# Altium project CubeSatTelemetry2.PrjPcb (part 2 of 2)

## Sheet LTEMSubsystem.SchDoc
size A3; SheetNumber: 4; SheetTotal: 14
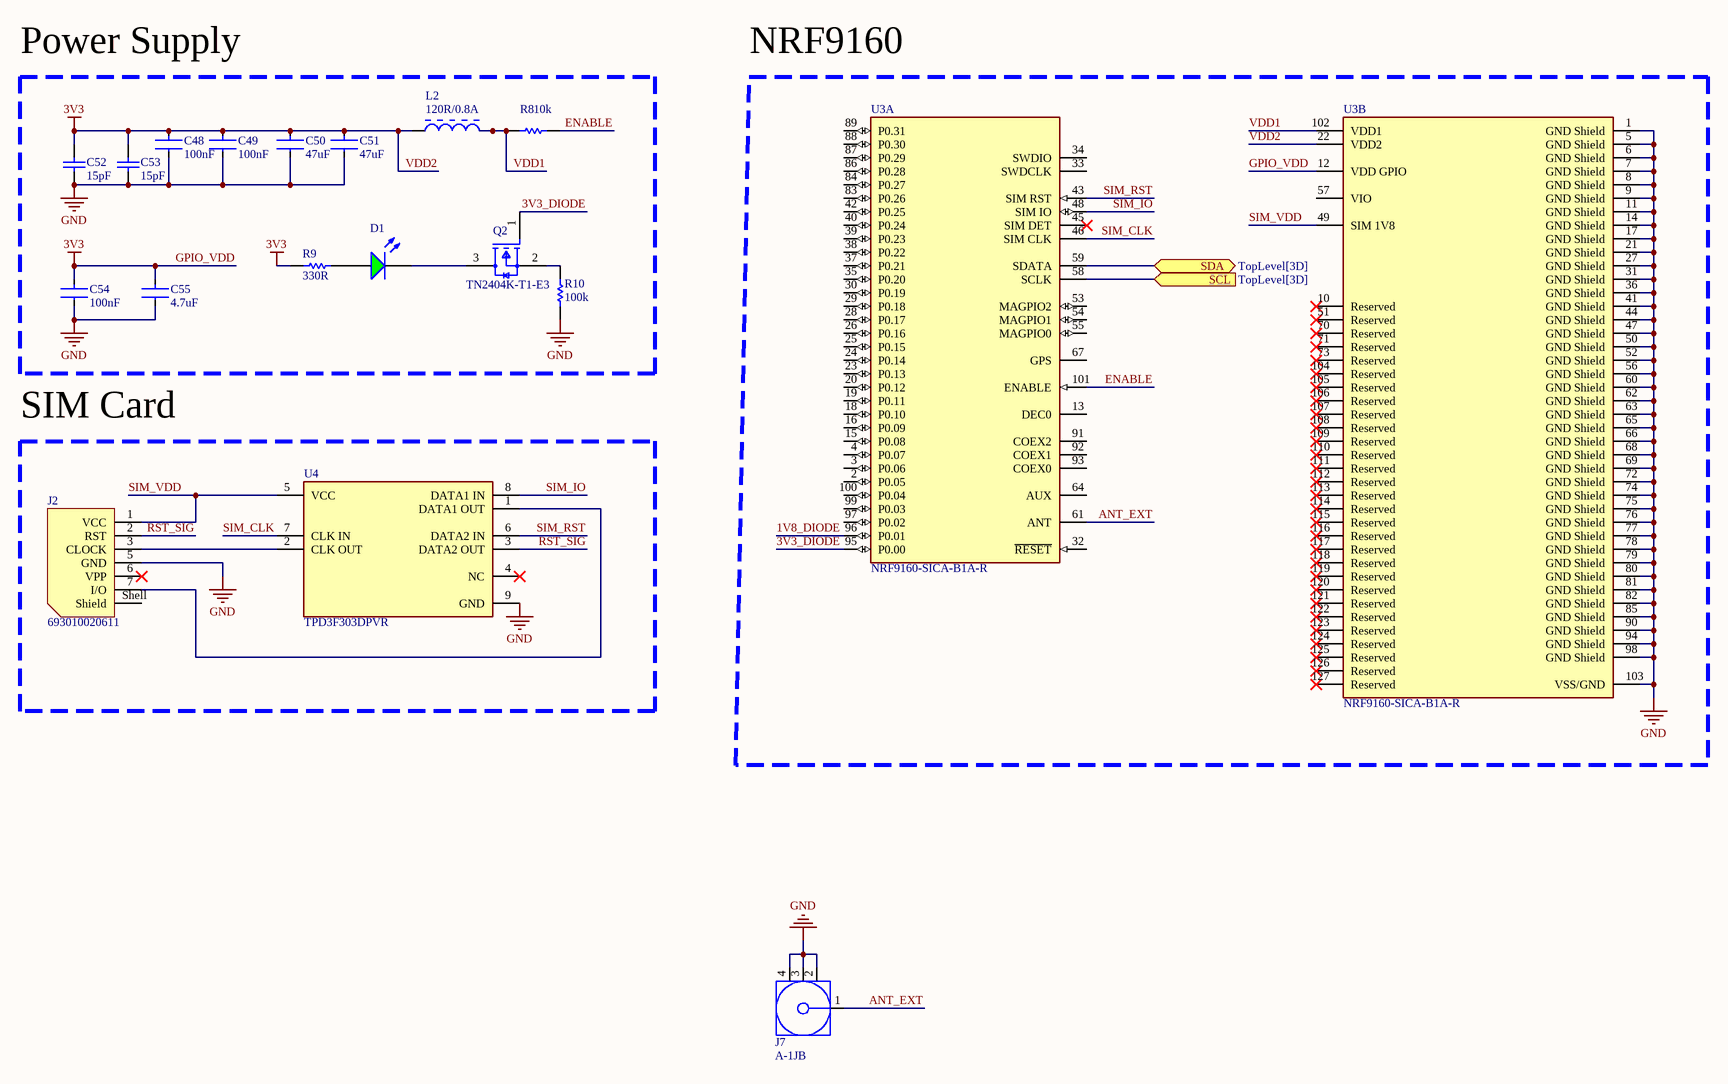
[diagram p6: LTEMSubsystem.SchDoc]

### Parts
C48  100nF  [FP-GRM033-0_03-MFG]
C49  100nF  [FP-GRM033-0_03-MFG]
C50  47uF  [FP-C3216-160-0_2-MFG]
C51  47uF  [FP-C3216-160-0_2-MFG]
C52  15pF  [CAPC1508X91X25LL25T13]
C53  15pF  [CAPC1508X91X25LL25T13]
C54  100nF  [FP-GRM033-0_03-MFG]
C55  4.7uF  [FP-C0603-CG-MFG]
D1  (no value)  [WL-SMRW_1206_cylindrical_reverse use]
J2  693010020611  [693010020611]
J7  A-1JB  [AMPH-A-1JB_V]
L2  120R/0.8A  [LIRD-LI0805H151R-10-2_V]
Q2  TN2404K-T1-E3  [FP-S-03946-MFG]
R8  10k  [RESC1609X50X30NL8T20]
R9  330R  [RESC1005X40X25ML05T05]
R10  100k  [RESC1005X40X25NL10T10]
U3  NRF9160-SICA-B1A-R  [FP-NRF9160-SICA-B1A-R-MFG]  (parts A,B of 2)
U4  TPD3F303DPVR  [FP-DPV0008A-IPC_C]

### Blocks framed on the sheet
Power Supply: C48-C55 D1 L2 Q2 R8-R10
NRF9160: U3
SIM Card: J2 U4

### Ports
SCL (in, see TopLevel[3D]), SDA (bidir, see TopLevel[3D])

### Nets
GND: C48.2 C49.2 C50.2 C51.2 C52.1 C53.1 C54.2 C55.2 J2.5(GND) J7.2 J7.3 J7.4 R10.2 U3.1(GND_Shield) U3.5(GND_Shield) U3.6(GND_Shield) U3.7(GND_Shield) U3.8(GND_Shield) U3.9(GND_Shield) U3.11(GND_Shield) U3.14(GND_Shield) U3.17(GND_Shield) U3.21(GND_Shield) U3.27(GND_Shield) U3.31(GND_Shield) U3.36(GND_Shield) U3.41(GND_Shield) U3.44(GND_Shield) U3.47(GND_Shield) U3.50(GND_Shield) U3.52(GND_Shield) U3.56(GND_Shield) U3.60(GND_Shield) U3.62(GND_Shield) U3.63(GND_Shield) U3.65(GND_Shield) U3.66(GND_Shield) U3.68(GND_Shield) U3.69(GND_Shield) U3.72(GND_Shield) U3.74(GND_Shield) U3.75(GND_Shield) U3.76(GND_Shield) U3.77(GND_Shield) U3.78(GND_Shield) U3.79(GND_Shield) U3.80(GND_Shield) U3.81(GND_Shield) U3.82(GND_Shield) U3.85(GND_Shield) U3.90(GND_Shield) U3.94(GND_Shield) U3.98(GND_Shield) U3.103(VSS/GND) U4.9(GND)
GPIO_VDD: C48.1 C49.1 C50.1 C51.1 C52.2 C53.2 C54.1 C55.1 L2.1 R9.1 U3.12(VDD_GPIO) U3.22(VDD2)  [also labelled 3V3, VDD2]
1V8_DIODE: U3.96(P0.01)
3V3_DIODE: Q2.1(G) U3.95(P0.00)
ANT_EXT: J7.1 U3.61(ANT)
ENABLE: R8.2 U3.101(ENABLE)
RST_SIG: J2.2(RST) U4.3(DATA2_OUT)
SIM_CLK: U3.46(SIM_CLK) U4.7(CLK_IN)
SIM_IO: U3.48(SIM_IO) U4.8(DATA1_IN)
SIM_RST: U3.43(SIM_RST) U4.6(DATA2_IN)
SIM_VDD: J2.1(VCC) U3.49(SIM_1V8) U4.5(VCC)
VDD1: L2.2 R8.1 U3.102(VDD1)
NetD1_1: D1.1(K) Q2.3(D)
NetD1_2: D1.2(A) R9.2
NetJ2_3: J2.3(CLOCK) U4.2(CLK_OUT)
NetJ2_7: J2.7(I/O) U4.1(DATA1_OUT)
NetQ2_2: Q2.2(S) R10.1
NetR39_2: U3.59(SDATA) ; port SDA
NetR40_2: U3.58(SCLK) ; port SCL

Not connected (* = marked no-connect by the designer): J2 6(VPP)* Shell(Shield); U3 2(P0.05) 3(P0.06) 4(P0.07) 10(Reserved)* 13(DEC0) 15(P0.08) 16(P0.09) 18(P0.10) 19(P0.11) 20(P0.12) 23(P0.13) 24(P0.14) 25(P0.15) 26(P0.16) 28(P0.17) 29(P0.18) 30(P0.19) 32(~{RESET}) 33(SWDCLK) 34(SWDIO) 35(P0.20) 37(P0.21) 38(P0.22) 39(P0.23) 40(P0.24) 42(P0.25) 45(SIM_DET)* 51(Reserved)* 53(MAGPIO2) 54(MAGPIO1) 55(MAGPIO0) 57(VIO) 64(AUX) 67(GPS) 70(Reserved)* 71(Reserved)* 73(Reserved)* 83(P0.26) 84(P0.27) 86(P0.28) 87(P0.29) 88(P0.30) 89(P0.31) 91(COEX2) 92(COEX1) 93(COEX0) 97(P0.02) 99(P0.03) 100(P0.04) 104(Reserved)* 105(Reserved)* 106(Reserved)* 107(Reserved)* 108(Reserved)* 109(Reserved)* 110(Reserved)* 111(Reserved)* 112(Reserved)* 113(Reserved)* 114(Reserved)* 115(Reserved)* 116(Reserved)* 117(Reserved)* 118(Reserved)* 119(Reserved)* 120(Reserved)* 121(Reserved)* 122(Reserved)* 123(Reserved)* 124(Reserved)* 125(Reserved)* 126(Reserved)* 127(Reserved)*; U4 4(NC)*

### Library data of the parts
C48 C49 C54 = CMP-06035-000062-2: GRM033R60J104KE19D; Dielectric: X5R; Voltage Rating (DC): 6.3V; Material: Ceramic; Tolerance: 10%; Min Operating Temperature: -55°C; Lead Free: Lead Free; Radiation Hardening: No; REACH SVHC: No SVHC; Case/Package: 0201; Voltage Rating: 6.3V; Length: 0.6mm; Max Operating Temperature: 85°C; Width: 0.012inch; Depth: 0.3mm; Case Code (Metric): 0603; Thickness: 0.013inch; Packaging: Tape and Reel; Height: 0.3mm; Capacitance: 100nF; Weight: 6E-06oz; Package Quantity: 1; Mount: Surface Mount; Voltage: 6.3V; Case Code (Imperial): 0201; Termination: SMD/SMT
C50 C51 = CMP-2000-07442-2: C3216X5R1C476M160AB; Dielectric: X5R; Dielectric Material: Ceramic; Tolerance: 20%; Voltage Rating (DC): 16V; Resistor Type: Ceramic; Width: 0.063inch; Case Code (Imperial): 1206; Radiation Hardening: No; Thickness: 0.071inch; Weight: 0.000571oz; Termination: SMD/SMT; Min Operating Temperature: -55°C; Depth: 1.6mm; Case Code (Metric): 3216; Max Operating Temperature: 85°C; RoHS Compliant: Yes; REACH SVHC: No SVHC; Mount: Surface Mount; Lead Free: Lead Free; Height: 1.6mm; Length: 3.2mm; Capacitance: 47uF; Package Quantity: 1; Construction: Flat; Packaging: Tape and Reel; Series: C; Case/Package: 1206; Voltage Rating: 16V
C52 C53 = CMP-2006-04659-1: 06032U150GAT2A; Manufacturer: AVX Interconnect / Elco; Part Number: 06032U150GAT2A
C55 = CMP-2006-02256-2: C0603C475K9PACTU; Manufacturer: Kemet; Temperature Coefficient: 15%; Tolerance: 10%; Voltage Rating: 6.3V; Material: Ceramic; Temperature Characteristic: X5R; Device Class L3: Ceramic Capacitors; RoHS: TRUE; Value: 4.7uF; Lead Free: Yes; ComponentLink2Description: Datasheet; Mouser Description: Multilayer Ceramic Capacitors MLCC - SMD/SMT 6.3volts 4.7uF X5R 10%; Package: C0603-CG; Digikey Description: CAP CER 4.7UF 6.3V X5R 0603; ComponentLink2URL: https://content.kemet.com/datasheets/KEM_C1006_X5R_SMD.pdf; Category: Cap; Temperature Range Low: -55°C; Capacitance: 4.7uF; Temperature: -55°C to +85°C; Octopart: https://octopart.com/c0603c475k9pactu-kemet-104242; Ipc Land Pattern Name: CAPC16080X80; Temperature Range High: +85°C; Height: 0.9mm; Device Class L1: Passive Components; Manufacturer Part Number: C0603C475K9PACTU; Automotive: No; Device Class L2: Capacitors
D1 = CMP-1428-00004-3: 156120GS75300; NexarPartId: 29717826; Reverse Voltage: 5V; Forward Current: 100mA; Luminous Intensity: 235mcd; Lens Style: Cylindrical; Power Dissipation: 95mW; Test Current: 20mA; Forward Voltage: 3.3V; Peak Wavelength: 520nm; Wavelength: 525nm; Viewing Angle: 140°; Color: Green; Case Code (Metric): 3216; Height: 1.2mm; RoHS: Compliant; Packaging: Tape and Reel; Width: 1.6mm; Lead Free: Lead Free; Case/Package: 1206; Length: 3.2mm; Max Operating Temperature: 85°C; REACH SVHC: Unknown; Dominant Wavelength: 525nm; Min Operating Temperature: -40°C; Mount: Surface Mount; Case Code (Imperial): 1206; Max Reverse Voltage (DC): 5V
J2 = CMP-1502-00155-2: NexarPartId: 22862857; Connector Type: Connector, Socket; Operating Supply Voltage: 50V; Insulation Resistance: 500MΩ; Number of Contacts: 6; Current Rating: 500mA; Max Operating Temperature: 85°C; Number of Pins: 6; Min Operating Temperature: -25°C; Mount: Surface Mount; Contact Material: Copper; REACH SVHC: Unknown; Packaging: Tape and Reel; Length: 16.4mm; Width: 16.3mm; RoHS: Compliant; Height: 1.8mm; Number of Positions: 6; Contact Plating: Gold
J7 = CMP-1743-00001-1: AMC PCB Jack, 0 to 60 GHz, 60 V, -40 to 90 degC, 4-Pin SMD, RoHS, Tape and Reel; Capacitance: 100 uF; Case\Package: 2917; Voltage Rating (DC): 10 V; ESR: 700 mohm; Tolerance: 10%; ComponentLink1Description: Datasheet; PackageDescription: 4-Pin Surface Mount Device, Body 2.6 x 2.6 mm; Radiation Hardening: No; Package Quantity: 1; REACH SVHC: No SVHC; DatasheetVersion: Rev. K, 05/2016; ComponentLink1URL: http://drawings.amphenolrf.com/Customer_Outline/CA-1JB.pdf; Pins: 2; Packaging: Tape and Reel; Min Operating Temperature: -55 degC; RoHSCompliant: true; Length: 7.3 mm; PackageReference: A-1JB; Weight: 0.023634 oz; Mount: Surface Mount; Voltage Rating: 10 V; Max Operating Temperature: 125 degC; Height: 3.1 mm; Case Code (Imperial): 2917; Case Code (Metric): 7343; Width: 4.3 mm
L2 = CMP-2000-06542-1: LI0805H121R-10; Manufacturer: Laird; Package Version: Rev. D, 08/2013; Impedance @ Frequency: 120Ohm@100MHz; Other Names: 240-2383-1; Kits: 240-2227-ND-KITEMIFERRITEBEADCHIPSMD; DC Resistance (DCR) (Max): 150mOhm; Online Catalog: LISeries; Filter Type: SignalLine; Number of Lines: 1; Catalog Drawings: (HI,HZ,LI,MI)0805Series_1.10mmMax.Height; Current Rating (Max): 800mA; Category: Filters; Size / Dimension: 0.079"Lx0.049"W(2.00mmx1.25mm); Operating Temperature: -40°C~125°C; Datasheet Version: Rev. E, 08/2013; Datasheet URL: http://cdn.lairdtech.com/home/brandworld/files/LI0805H121R-10.pdf; Package Description: 2-Pin Surface Mount Device, Body 2 x 1.25 mm; Package Reference: LI0805H15R-10-2; Mounting Type: SurfaceMount; Package / Case: 0805(2012Metric); Series: LI; Package URL: http://cdn.lairdtech.com/home/brandworld/files/LI0805H151R-10.pdf; Ratings: -; Manufacturer URL: https://www.lairdtech.com/; Family: FerriteBeadsandChips; Height (Max): 0.043"(1.10mm); Standard Package: 1; Mounting Technology: SurfaceMount; Packaging: CutTape(CT)
Q2 = CMP-00030-39730086-1: TN2404K-T1-E3 Single N-Channel 240 V 4 Ohms Surface Mount Power Mosfet - SOT-23; Number of Elements: 1; Drain to Source Breakdown Voltage: 240V; Nominal Vgs: 800mV; Max Junction Temperature (Tj): 150°C; Turn-Off Delay Time: 35ns; Max Power Dissipation: 360mW; Rds On Max: 4Ω; Drain to Source Resistance: 2.2Ω; Turn-On Delay Time: 5ns; Rise Time: 12ns; Continuous Drain Current (ID): 200mA; Gate to Source Voltage (Vgs): 20V; Number of Pins: 3; Contact Plating: Tin; Length: 3.04mm; Lead Free: Lead Free; Mount: Surface Mount; Weight: 1.437803g; Number of Channels: 1; Height: 1.02mm; Max Operating Temperature: 150°C; Min Operating Temperature: -55°C; Case/Package: SOT-23-3; Width: 1.4mm; Radiation Hardening: No; Resistance: 4Ω; Schedule B: 8541210080, 8541210080; Power Dissipation: 360mW; Drain to Source Voltage (Vdss): 240V; Fall Time: 12ns; Element Configuration: Single; RoHS: Compliant; NexarPartId: 39730086; Threshold Voltage: 800mV; REACH SVHC: Unknown
R8 = CMP-1666-00005-4: CRCW060310K0FKEA; Manufacturer: Vishay Semiconductor; Voltage Rating: 75 V; Max Operating Temperature: 155 degC; PackageDescription: 2-Pin Surface Mount Device, Body 1.575 x 0.85 mm; ComponentLink1Description: Manufacturer URL; RoHSCompliant: true; PackageReference: 0603; REACH SVHC: Unknown; Length: 1.55 mm; DatasheetVersion: 06/2012; Packaging: Tape and Reel; Min Operating Temperature: -55 degC; Mounting Technology: Surface Mount; ComponentLink2URL: https://datasheet.ciiva.com/11809/0900766b80d98afc-11809037.pdf; Height: 0.45 mm; ComponentLink2Description: Datasheet; Package Quantity: 5000; ComponentLink1URL: http://www.vishay.com/
R9 = CMP-2002-01143-1: ERJ2RKF3300X; Manufacturer: Panasonic; Part Number: ERJ2RKF3300X
R10 = CMP-2002-05837-1: ERA-2AED104X; Manufacturer: Panasonic; Part Number: ERA-2AED104X
U3 = CMP-03900-112853535-1: NRF9160-SICA-B1A-R LTE-M/NB-IoT/GPS Module 700MHz to 2200MHz 3.3V to 5.5V LGA; Min Supply Voltage: 3V; Number of ADC Channels: 8; Bandwidth: 1.5GHz; Data Rate: 8Mbps; Interface: I2C, I2S, SPI, UART; Max Frequency: 2.2GHz; Number of GPIO: 32; Max Supply Voltage: 5.5V; Ambient Temperature Range High: 85°C; Max Operating Temperature: 85°C; NexarPartId: 112853535; Min Operating Temperature: -40°C; Height: 1.1mm
U4 = CMP-0326-00035-4: FILTER RC(PI) ESD SMD; Number of Channels: 3; Frequency: 308MHz; Capacitance: 20pF; Operating Supply Voltage: 5.5V; Clamping Voltage: 10V; ESD Protection: Yes; Contact Plating: Gold; Lead Free: Lead Free; REACH SVHC: No SVHC; Radiation Hardening: No; Width: 0.063inch; Height: 0.026inch; Number of Pins: 8; Depth: 1.7mm; RoHS Compliant: Yes; Case/Package: SMD/SMT; Termination: Flat; Length: 2.2mm; Min Operating Temperature: -40°C; Series: TPD3F303; Operating Frequency: 308MHz; Packaging: Tape and Reel; Max Operating Temperature: 85°C; Package Quantity: 1

## Sheet MicroSDcard.SchDoc
size A4; SheetNumber: 6; SheetTotal: 13
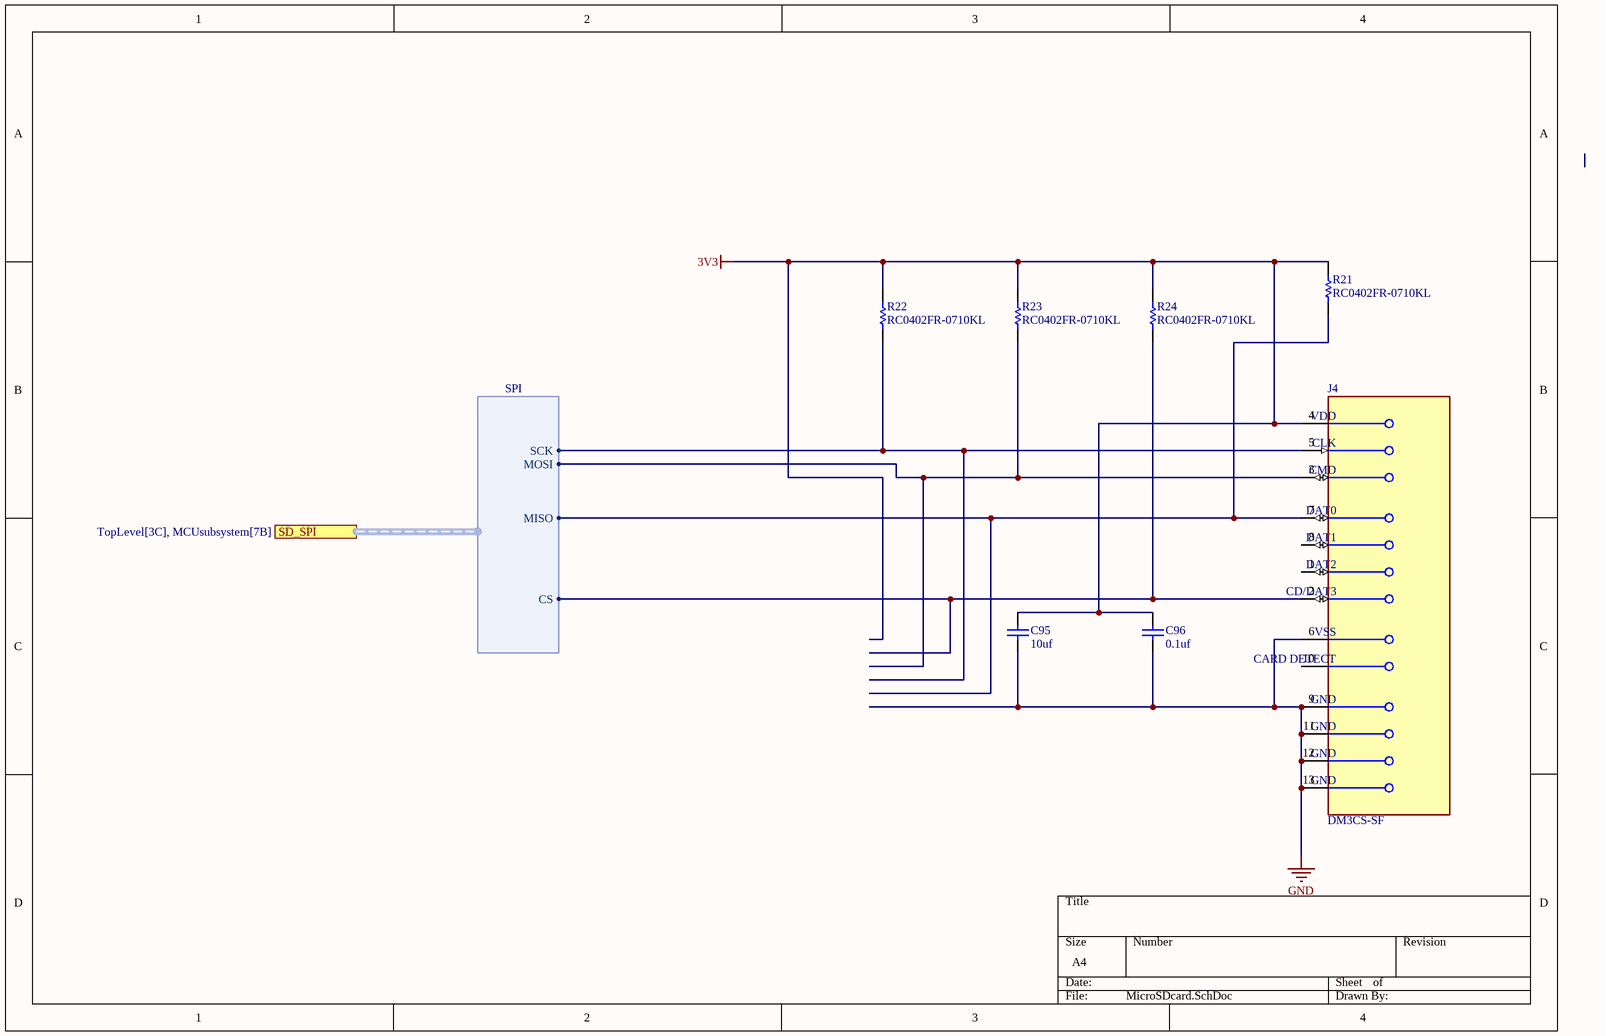
[diagram p7: MicroSDcard.SchDoc]

### Parts
C95  10uf  [CAPC1005X56X25NL10T15]
C96  0.1uf  [CAPC1608X90X35LL15T15]
J4  DM3CS-SF  [FP-DM3CS-SF-MFG]
R21  RC0402FR-0710KL  [RESC1005X40X25LL05T10]
R22  RC0402FR-0710KL  [RESC1005X40X25LL05T10]
R23  RC0402FR-0710KL  [RESC1005X40X25LL05T10]
R24  RC0402FR-0710KL  [RESC1005X40X25LL05T10]

### Ports
SD_SPI (harness SPI, see TopLevel[3C], MCUsubsystem[7B])

### Harnesses
SPI: SCK, MISO, MOSI, CS

### Nets
3V3: C95.1 C96.2 J4.4(VDD) R21.2 R22.2 R23.2 R24.2  [project net GPIO_VDD]
GND: C95.2 C96.1 J4.6(VSS) J4.9(GND) J4.11(GND) J4.12(GND) J4.13(GND)
NetJ4_2: J4.2(CD/DAT3) R24.1 ; port SD_SPI.CS
NetJ4_3: J4.3(CMD) R23.1 ; port SD_SPI.MOSI
NetJ4_5: J4.5(CLK) R22.1 ; port SD_SPI.SCK
NetJ4_7: J4.7(DAT0) R21.1 ; port SD_SPI.MISO

Not connected (* = marked no-connect by the designer): J4 1(DAT2) 8(DAT1) 10(CARD_DETECT)

### Library data of the parts
C95 = CMP-2008-02890-1: Part Number: 0402ZD225MAT2A; Manufacturer: AVX Interconnect / Elco
C96 = CMP-2006-04199-2: Chip Capacitor, 100 nF, 25 V, -30 to 85 degC, 0603 (1608 Metric), RoHS, Tape and Reel; Manufacturer: AVX; Dielectric: Y5V; Rated Voltage: 25V; Tolerance (%): -20to+80%; Capacitance: 100nF; Datasheet Version: 01/2010; Package Description: 2-Pin Surface Mount Device, Body 1.6 x 0.8 mm; Manufacturer URL: http://www.avx.com/; Datasheet URL: http://datasheet.octopart.com/06033G104ZAT2A-AVX-datasheet-8445862.pdf; Package Reference: 0603; Case Size/Dimension: 0603; Mounting Technology: SurfaceMount
J4 = CMP-11597-000003-1: CONN MICRO SD CARD HINGED TYPE; Pitch: 1.1mm; Connector Type: Connector; Current Rating: 500mA; Voltage Rating (AC): 125V; Gender: Female; Insulation Resistance: 1GR; Number of Positions: 8; Contact Resistance: 100mR; Packaging: Tape and Reel; Flammability Rating: UL94 V-0; Lead Free: Lead Free; Min Operating Temperature: -25°C; Orientation: Right Angle; Width: 13.8mm; Number of Rows: 1; Housing Material: Polymer; Package Quantity: 1; Mount: Surface Mount; Max Current Rating: 500mA; Radiation Hardening: No; Max Operating Temperature: 85°C; Contact Plating: Gold; Depth: 1.83mm; Contact Material: Gold; Length: 14.1mm; Number of Contacts: 8; Termination: Solder
R21-R24 = CMP-2002-07353-1: Manufacturer: Yageo / Phycomp; Part Number: RC0402FR-0710KL

## Sheet PowerSubsystem.SchDoc
size A4; SheetNumber: 8; SheetTotal: 14
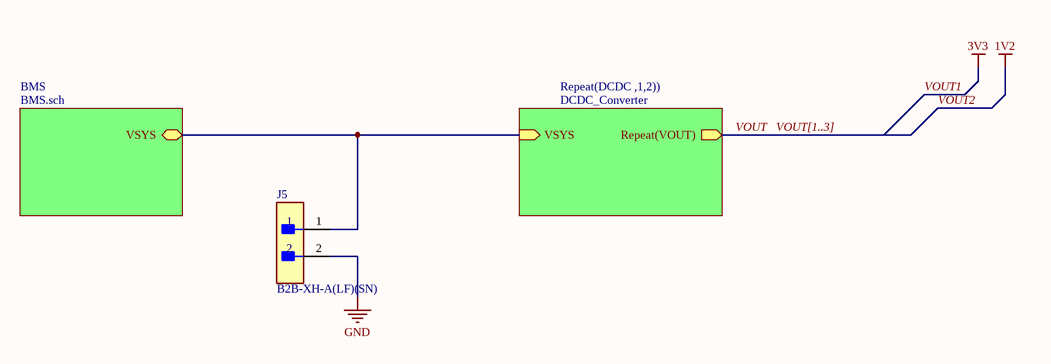
[diagram p8: PowerSubsystem.SchDoc]

### Parts
J5  B2B-XH-A(LF)(SN)  [FP-B2B-XH-A_LF_SN-MFG]

### Sub-sheets
BMS = BMS.sch (file not in this document): VSYS (bidir)
Repeat(DCDC ,1,2)) = DCDC_Converter: Repeat(VOUT) (out), VSYS (in)

### Nets
GND: J5.2
VSYS: J5.1 ; sheet BMS/VSYS, sheet Repeat(DCDC ,1,2))/VSYS

### Buses and harness runs
bus VOUT[1..3]

### Library data of the parts
J5 = CMP-2000-05888-3: CONN HEADER VERT 2POS 2.5MM; Current Rating: 3A; Voltage Rating: 250V; Number of Contacts: 2; Contact Resistance: 20mR; Wire/Cable Gauge: 22AWG; Insulation Resistance: 1GR; Connector Type: Male Pin; Packaging: Bulk; Contact Material: Brass; Lead Free: Lead Free; Orientation: Straight; Contact Plating: Tin; Max Current Rating: 3A; Termination: Solder; Fastening Type: Detent; Depth: 5.75mm; Housing Material: Polyamide; REACH SVHC: No SVHC; Series: XH; Voltage Rating (AC): 250V; Number of Positions: 2; Color: Natural; Contact Type: Male Pin; Max Voltage Rating (DC): 250V; Pitch: 2.5mm; Lead Pitch: 2.5mm; Mount: Through Hole; Max Operating Temperature: 85°C; Length: 7.4mm; Max Voltage Rating (AC): 250V; Min Operating Temperature: -25°C; Number of Rows: 1; Housing Color: White

## Sheet DCDC_Converter.SchDoc
size A4; SheetNumber: 10; SheetTotal: 14
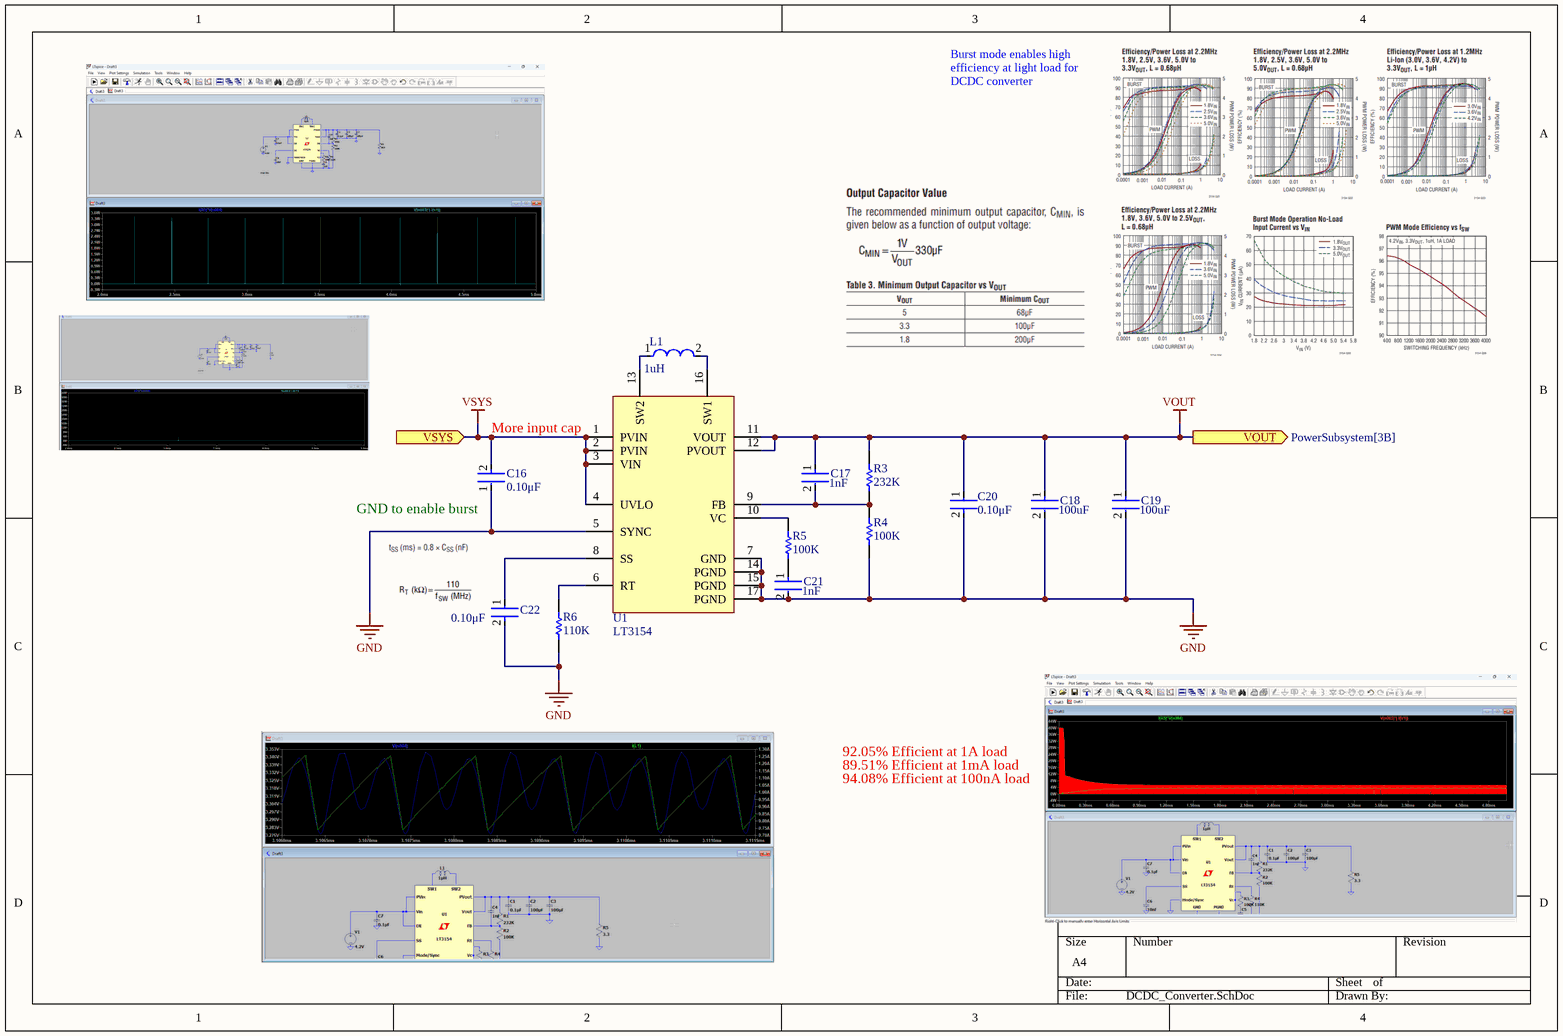
[diagram p9: DCDC_Converter.SchDoc]

### Parts
(Parts that share a designator on the sheet are numbered #1, #2 ... from top to bottom, then left to right.)
C16  Capacitance: 0.10μF  [FP-GRM15-MFG]  (hidden comment: GRM155R71C104KA88D)
C17  Capacitance: 1nF  [FP-GRM155-0_05-IPC_B]  (hidden comment: GRM1555C1H102JA01D)
C18  Capacitance: 100uF  [FP-GRM32E-0_3-0_2-IPC_B]  (hidden comment: GRM32ER61A107ME20L)
C19  Capacitance: 100uF  [FP-GRM32E-0_3-0_2-IPC_B]  (hidden comment: GRM32ER61A107ME20L)
C20  Capacitance: 0.10μF  [FP-GRM15-MFG]  (hidden comment: GRM155R71C104KA88D)
C21  Capacitance: 1nF  [FP-GRM155-0_05-IPC_B]  (hidden comment: GRM1555C1H102JA01D)
C22  Capacitance: 0.10μF  [FP-GRM15-MFG]  (hidden comment: GRM155R71C104KA88D)
L1  Inductance: 1uH  [FP-MLP2012M-IPC_C]  (hidden comment: MLP2012S1R0MT0S1)
R3  232K  [RESC1005X40X25NL10T10]
R4  100K  [RESC1005X40X25NL10T10]
R5  100K  [RESC1005X40X25NL10T10]
R6  110K  [RESC1005X40X25LL05T05]
U1#2  LT3154  [PQFN127P600-8N]

### Ports
VOUT (out, see PowerSubsystem[3B]), VSYS (in, see PowerSubsystem[3B], BMS[4C])

### Nets
GND: C16.1 C18.2 C19.2 C20.2 C21.2 C22.2 R4.1 R6.1 U1#2.5(SYNC) U1#2.7(GND) U1#2.14(PGND) U1#2.15(PGND) U1#2.17(PGND)
VOUT: C17.1 C18.1 C19.1 C20.1 R3.2 U1#2.11(VOUT) U1#2.12(PVOUT) ; port VOUT
VSYS: C16.2 U1#2.1(PVIN) U1#2.2(PVIN) U1#2.3(VIN) U1#2.4(UVLO) ; port VSYS
NetC17_2: C17.2 R3.1 R4.2 U1#2.9(FB)
NetC21_1: C21.1 R5.1
NetC22_1: C22.1 U1#2.8(SS)
NetL1_1: L1.1 U1#2.13(SW2)
NetL1_2: L1.2 U1#2.16(SW1)
NetR5_2: R5.2 U1#2.10(VC)
NetR6_2: R6.2 U1#2.6(RT)

### Notes on the sheet
- Burst mode enables high efficiency at light load for DCDC converter
- (near U1#2) More input cap
- (near C16) GND to enable burst
- 92.05% Efficient at 1A load
- 89.51% Efficient at 1mA load
- 94.08% Efficient at 100nA load

### Library data of the parts
C16 C20 C22 = CMP-2100-03641-2: CAP CER 0.1UF 16V X7R 0402; Manufacturer: Murata; Standoff Height: 0mm; Tolerance: 10%; Voltage Rating: 16Vdc; Material: Ceramic; Value: 0.10μF; RoHS: TRUE; Manufacturer Part Number: GRM155R71C104KA88D; Temperature Characteristic: X7R; Octopart: https://octopart.com/grm155r71c104ka88d-murata-196880; Digikey Description: CAP CER 0.1UF 16V X7R 0402; Device Class L3: Ceramic Capacitors; Height: 0.55mm; ComponentLink2Description: Datasheet; Temperature Range Low: -55°C; Ipc Land Pattern Name: CAPC10050X219; ComponentLink2URL: https://search.murata.co.jp/Ceramy/image/img/A01X/G101/ENG/GRM155R71H471KA01-01A.pdf; Device Class L1: Passive Components; Lead Free: yes; Category: Cap; Package: GRM15; Temperature: -55°C to +125°C; Device Class L2: Capacitors; Temperature Range High: +125°C; Mouser Description: 0402 0.1 uF 16V ±10 % Tolerance X7R SMT Multilayer Ceramic Capacitor
C17 C21 = CMP-2008-04254-2: Chip Multilayer Ceramic Capacitors for General Purpose, 0402, 1000pF, C0G, 30ppm/°C, 5%, 50V; Insulation Resistance: 10GR; Packaging: Tape and Reel; Lead Free: Lead Free; Tolerance: 5%; Temperature Coefficient: 30ppm/°C; Thickness: 0.022inch; Termination: SMD/SMT; Max Operating Temperature: 125°C; Height: 0.5mm; Package Quantity: 1; Radiation Hardening: No; Material: Ceramic; Case Code (Metric): 1005; Number of Pins: 2; Voltage Rating: 50V; Mount: Surface Mount; Voltage: 50V; Case/Package: 0402; Min Operating Temperature: -55°C; Dielectric Material: Ceramic; Width: 0.5mm; Depth: 0.5mm; Case Code (Imperial): 0402; REACH SVHC: No SVHC; Dielectric: C0G; Voltage Rating (DC): 50V; Length: 1mm
C18 C19 = CMP-06035-048205-1: Chip Multilayer Ceramic Capacitors for General Purpose, 1210, 100uF, X5R, 15%, 20%, 10V; Dissipation Factor: 0.035%; Packaging: Tape and Reel; Width: 2.5mm; Case/Package: 1210; Min Operating Temperature: -55°C; Depth: 2.5mm; Package Quantity: 1000; Case Code (Imperial): 1210; Voltage Rating: 10V; Dielectric Material: Ceramic; Length: 3.2mm; Lead Free: Lead Free; REACH SVHC: No SVHC; Mount: Surface Mount; Height: 2.5mm; Voltage Rating (DC): 10V; Dielectric: X5R; Thickness: 0.106inch; Weight: 0.00388oz; Material: Ceramic; Termination: SMD/SMT; Tolerance: 20%; Case Code (Metric): 3225; Voltage: 10V; Max Operating Temperature: 85°C
L1 = CMP-08253-000385-1: Shielded Multilayer Inductor 1uH ±20% 1000mA 208mΩ SMD 0805; Test Frequency: 2MHz; Current Rating: 1A; DC Resistance (DCR): 208mR; Core Material: Ferrite; RoHS Compliant: Yes; Min Operating Temperature: -40°C; Length: 0.079inch; Shielding: Shielded; Tolerance: 20%; Max Operating Temperature: 125°C; Case Code (Metric): 2012; Packaging: Cut Tape; Width: 0.049inch; Mount: Surface Mount; Case Code (Imperial): 0805; Height - Seated (Max): 0.039inch; Package Quantity: 4000; Case/Package: 0805
R3-R5 = CMP-2002-04173-1: Part Number: RK73H1ETTP1003F; Manufacturer: KOA Speer
R6 = CMP-2002-00441-1: Manufacturer: Panasonic; Part Number: ERJ-2GEJ114X
U1#2 = LT3154: 5.5V 6A Low-IQ Monolithic / Buck-Boost DC/DC Converter

## Sheet PreciseGNSS.SchDoc
size A4; SheetNumber: 11; SheetTotal: 14
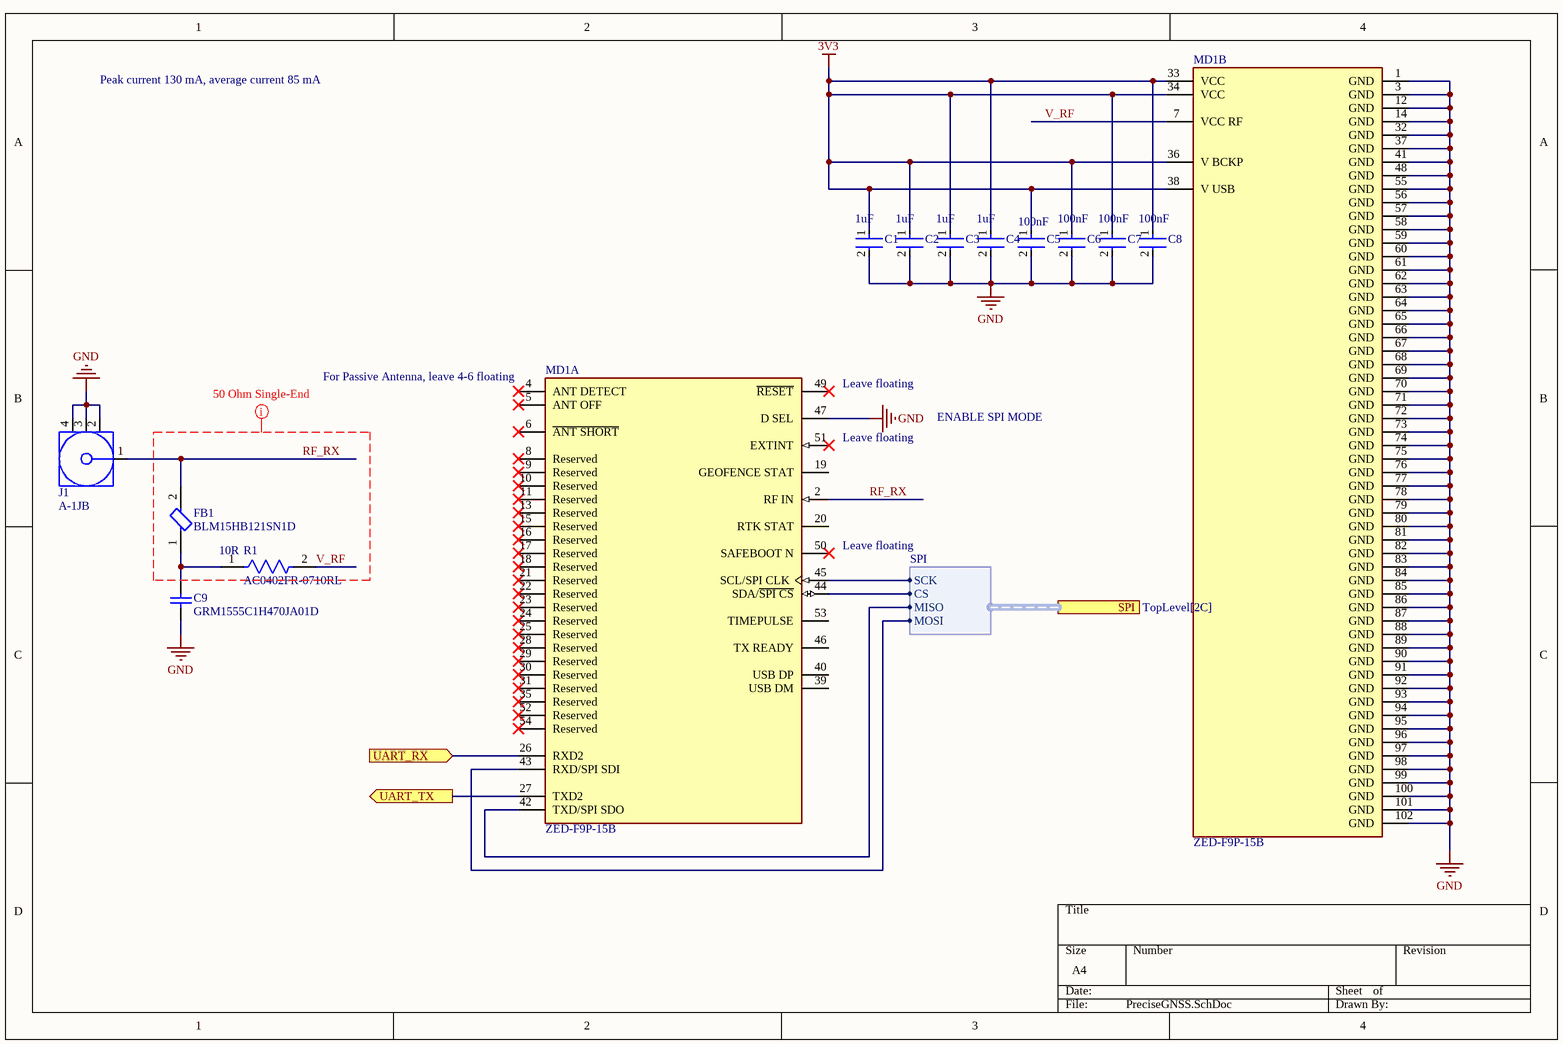
[diagram p10: PreciseGNSS.SchDoc]

### Parts
C1  Capacitance: 1uF  [FP-CL511-IPC_C]  (hidden comment: CL05A105KP5NNNC)
C2  Capacitance: 1uF  [FP-CL511-IPC_C]  (hidden comment: CL05A105KP5NNNC)
C3  Capacitance: 1uF  [FP-CL511-IPC_C]  (hidden comment: CL05A105KP5NNNC)
C4  Capacitance: 1uF  [FP-CL511-IPC_C]  (hidden comment: CL05A105KP5NNNC)
C5  Capacitance: 100nF  [FP-GRM155-0_05-IPC_C]  (hidden comment: GRM155R71E104KE14J)
C6  Capacitance: 100nF  [FP-GRM155-0_05-IPC_C]  (hidden comment: GRM155R71E104KE14J)
C7  Capacitance: 100nF  [FP-GRM155-0_05-IPC_C]  (hidden comment: GRM155R71E104KE14J)
C8  Capacitance: 100nF  [FP-GRM155-0_05-IPC_C]  (hidden comment: GRM155R71E104KE14J)
C9  GRM1555C1H470JA01D  [CAPC1005X55X25LL05T10]
FB1  BLM15HB121SN1D  [FP-BLM15-0_05-IPC_B]
J1  A-1JB  [AMPH-A-1JB_V]
MD1  ZED-F9P-15B  [FP-ZED-F9P-15B-MFG]  (parts A,B of 2)
R1  AC0402FR-0710RL  Resistance: 10R  [FP-AC0402-IPC_B]

### Ports
SPI (harness SPI, see TopLevel[2C]), UART_RX (in), UART_TX (out)

### Harnesses
SPI: SCK, MISO, MOSI, CS

### Nets
3V3: C1.1 C2.1 C3.1 C4.1 C5.1 C6.1 C7.1 C8.1 MD1.33(VCC) MD1.34(VCC) MD1.36(V_BCKP) MD1.38(V_USB)  [project net GPIO_VDD]
GND: C1.2 C2.2 C3.2 C4.2 C5.2 C6.2 C7.2 C8.2 C9.1 J1.2 J1.3 J1.4 MD1.1(GND) MD1.3(GND) MD1.12(GND) MD1.14(GND) MD1.32(GND) MD1.37(GND) MD1.41(GND) MD1.47(D_SEL) MD1.48(GND) MD1.55(GND) MD1.56(GND) MD1.57(GND) MD1.58(GND) MD1.59(GND) MD1.60(GND) MD1.61(GND) MD1.62(GND) MD1.63(GND) MD1.64(GND) MD1.65(GND) MD1.66(GND) MD1.67(GND) MD1.68(GND) MD1.69(GND) MD1.70(GND) MD1.71(GND) MD1.72(GND) MD1.73(GND) MD1.74(GND) MD1.75(GND) MD1.76(GND) MD1.77(GND) MD1.78(GND) MD1.79(GND) MD1.80(GND) MD1.81(GND) MD1.82(GND) MD1.83(GND) MD1.84(GND) MD1.85(GND) MD1.86(GND) MD1.87(GND) MD1.88(GND) MD1.89(GND) MD1.90(GND) MD1.91(GND) MD1.92(GND) MD1.93(GND) MD1.94(GND) MD1.95(GND) MD1.96(GND) MD1.97(GND) MD1.98(GND) MD1.99(GND) MD1.100(GND) MD1.101(GND) MD1.102(GND)
RF_RX: FB1.2 J1.1 MD1.2(RF_IN)
V_RF: MD1.7(VCC_RF) R1.2
NetC9_2: C9.2 FB1.1 R1.1
NetJ4_3: MD1.43(RXD/SPI_SDI) ; port SPI.MOSI
NetJ4_5: MD1.45(SCL/SPI_CLK) ; port SPI.SCK
NetJ4_7: MD1.42(TXD/SPI_SDO) ; port SPI.MISO
NetMD1_26: MD1.26(RXD2) ; port UART_RX
NetMD1_27: MD1.27(TXD2) ; port UART_TX
NetMD1_44: MD1.44(SDA/~{SPI_CS}) ; port SPI.CS

Not connected (* = marked no-connect by the designer): MD1 4(ANT_DETECT)* 5(ANT_OFF)* 6(~{ANT_SHORT})* 8(Reserved)* 9(Reserved)* 10(Reserved)* 11(Reserved)* 13(Reserved)* 15(Reserved)* 16(Reserved)* 17(Reserved)* 18(Reserved)* 19(GEOFENCE_STAT) 20(RTK_STAT) 21(Reserved)* 22(Reserved)* 23(Reserved)* 24(Reserved)* 25(Reserved)* 28(Reserved)* 29(Reserved)* 30(Reserved)* 31(Reserved)* 35(Reserved)* 39(USB_DM) 40(USB_DP) 46(TX_READY) 49(~{RESET})* 50(SAFEBOOT_N)* 51(EXTINT)* 52(Reserved)* 53(TIMEPULSE) 54(Reserved)*

### Layout directives
net class 50SE: RF_RX, V_RF

### Notes on the sheet
- Peak current 130 mA, average current 85 mA
- (near MD1) For Passive Antenna, leave 4-6 floating
- (near MD1) Leave floating
- ENABLE SPI MODE

### Library data of the parts
C1-C4 = CMP-13271-001936-1: Cap Ceramic 1uF 10V X5R ±10% SMD 0402 +85°C Paper T/R; Depth: 0.5mm; Case Code (Imperial): 0402; Material: Ceramic; Mount: Surface Mount; Thickness: 0.022inch; Dielectric: X5R; Radiation Hardening: No; Case/Package: 0402; Length: 1mm; Tolerance: 10%; Max Operating Temperature: 85°C; Package Quantity: 1; Width: 0.02inch; Voltage Rating: 10V; Contact Plating: Tin; Height: 0.5mm; Min Operating Temperature: -55°C; Case Code (Metric): 1005; Packaging: Tape and Reel
C5-C8 = CMP-06035-003995-1: Chip Multilayer Ceramic Capacitors for General Purpose, 0402, 0.10uF, X7R, 15%, 10%, 25V; Resistor Type: Ceramic; Tolerance: 10%; Case Code (Metric): 1005; Termination: SMD/SMT; Mount: Surface Mount; Voltage Rating: 25V; Voltage Rating (DC): 25V; Case Code (Imperial): 0402; Max Operating Temperature: 125°C; Weight: 0.000212oz; Case/Package: 0402; Length: 0.039inch; Width: 0.5mm; Thickness: 0.022inch; Height: 0.5mm; Packaging: Tape and Reel; Package Quantity: 50000; Min Operating Temperature: -55°C; Dielectric: X7R
C9 = CMP-2008-04368-1: Manufacturer: Murata; Part Number: GRM1555C1H470JA01D
FB1 = CMP-0686-00154-4: Chip Ferrite Bead, 0402, 120Ω @ 100MHz, 0.7Ω, 25%, 300mA; Impedance: 120R; DC Resistance (DCR): 700mR; Number of Lines: 1; Material: Steel; Lead Free: Lead Free; Min Operating Temperature: -55°C; Package Quantity: 10000; Tolerance: 25%; REACH SVHC: No SVHC; Termination: SMD/SMT; Number of Pins: 2; Frequency: 100MHz; Weight: 2.3E-05oz; Test Frequency: 100MHz; Series: BLM15H; Max DC Current: 300mA; Packaging: Tape and Reel; Width: 0.5mm; Max Current Rating: 300mA; Height: 0.5mm; Depth: 0.55mm; Case Code (Imperial): 0402; RoHS Compliant: Yes; Max Operating Temperature: 125°C; Current Rating: 300mA; Case Code (Metric): 1005; Number of Circuits: 1; Length: 1mm; Case/Package: 0402
J1 = CMP-1743-00001-1: as J7 on sheet LTEMSubsystem; ComponentLink1Description: Datasheet; PackageDescription: 4-Pin Surface Mount Device, Body 2.6 x 2.6 mm; Radiation Hardening: No; Package Quantity: 1; REACH SVHC: No SVHC; DatasheetVersion: Rev. K, 05/2016; ComponentLink1URL: http://drawings.amphenolrf.com/Customer_Outline/CA-1JB.pdf; Pins: 2; Packaging: Tape and Reel; Min Operating Temperature: -55 degC; RoHSCompliant: true; Length: 7.3 mm; PackageReference: A-1JB; Weight: 0.023634 oz; Mount: Surface Mount; Voltage Rating: 10 V; Max Operating Temperature: 125 degC; Height: 3.1 mm; Case Code (Imperial): 2917; Case Code (Metric): 7343; Width: 4.3 mm
MD1 = CMP-07419-140268250-1: ZED-F9P-15B GNSS / GPS Modules u-blox F9 dual band L1/L5 GNSS module high precision Professi; Interface: I2C, SPI, UART, USB; Min Supply Voltage: 1.65V; Max Supply Voltage: 3.6V; Data Rate: 400kbps; NexarPartId: 140268250; Max Operating Temperature: 85°C; Height: 2.6mm; Min Operating Temperature: -40°C
R1 = CMP-2002-01791-3: RES 10Ω ±1% 0.063W 0402; Temperature Coefficient: 200ppm/°C; Power Rating: 62.5mW; Voltage Rating: 50V; Max Power Dissipation: 63mW; Min Operating Temperature: -55°C; Packaging: Tape and Reel; Number of Terminations: 2; Max Operating Temperature: 155°C; Size Code: 0402; Ratings: AEC-Q200; Tolerance: 1%; Resistor Type: Thick Film; Length: 1mm; Width: 0.5mm; Height: 0.32mm; Termination: SMD/SMT; Case/Package: 0402; Case Code (Metric): 1005; Lead Free: Lead Free; Features: Moisture Resistant; Series: AC; Case Code (Imperial): 0402

## Sheet RoughGNSS.SchDoc
size A4; SheetNumber: 12; SheetTotal: 14
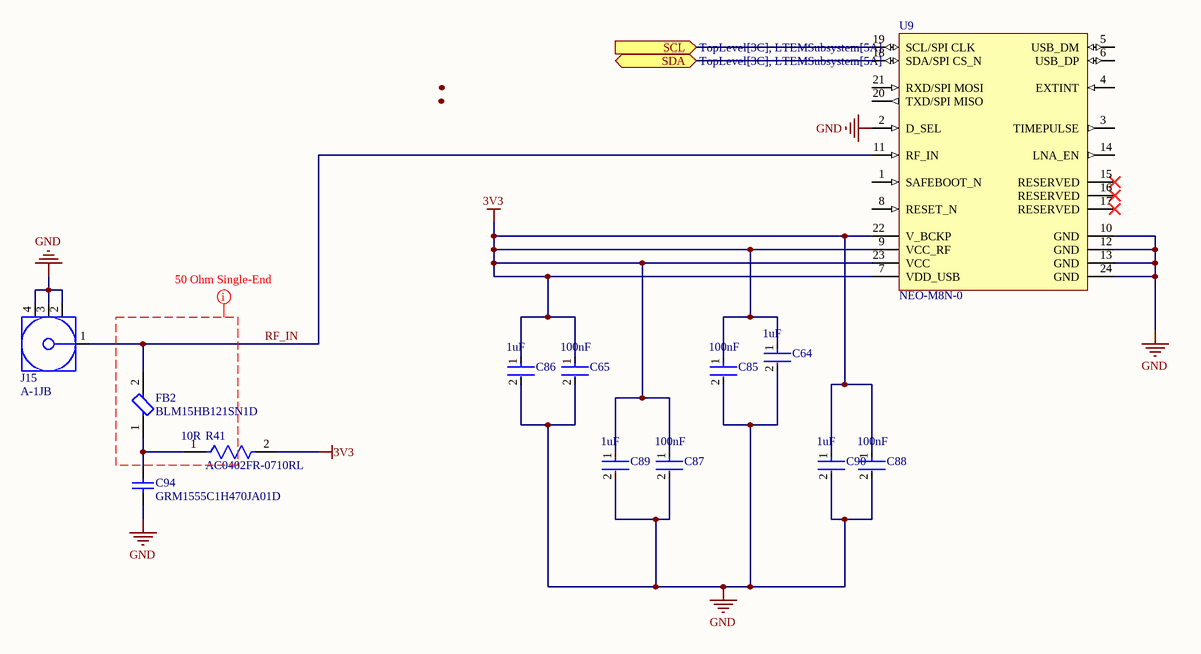
[diagram p11: RoughGNSS.SchDoc]

### Parts
C64  Capacitance: 1uF  [FP-CL511-IPC_C]  (hidden comment: CL05A105KP5NNNC)
C65  Capacitance: 100nF  [FP-GRM155-0_05-IPC_C]  (hidden comment: GRM155R71E104KE14J)
C85  Capacitance: 100nF  [FP-GRM155-0_05-IPC_C]  (hidden comment: GRM155R71E104KE14J)
C86  Capacitance: 1uF  [FP-CL511-IPC_C]  (hidden comment: CL05A105KP5NNNC)
C87  Capacitance: 100nF  [FP-GRM155-0_05-IPC_C]  (hidden comment: GRM155R71E104KE14J)
C88  Capacitance: 100nF  [FP-GRM155-0_05-IPC_C]  (hidden comment: GRM155R71E104KE14J)
C89  Capacitance: 1uF  [FP-CL511-IPC_C]  (hidden comment: CL05A105KP5NNNC)
C90  Capacitance: 1uF  [FP-CL511-IPC_C]  (hidden comment: CL05A105KP5NNNC)
C94  GRM1555C1H470JA01D  [CAPC1005X55X25LL05T10]
FB2  BLM15HB121SN1D  [FP-BLM15-0_05-IPC_B]
J15  A-1JB  [AMPH-A-1JB_V]
R41  AC0402FR-0710RL  Resistance: 10R  [FP-AC0402-IPC_B]
U9  NEO-M8N-0  [UBX-NEO-M8-24_V]

### Ports
SCL (in, see TopLevel[3C], LTEMSubsystem[5A]), SDA (bidir, see TopLevel[3C], LTEMSubsystem[5A])

### Nets
3V3: C64.1 C65.1 C85.1 C86.1 C87.1 C88.1 C89.1 C90.1 R41.2 U9.7(VDD_USB) U9.9(VCC_RF) U9.22(V_BCKP) U9.23(VCC)  [project net GPIO_VDD]
GND: C64.2 C65.2 C85.2 C86.2 C87.2 C88.2 C89.2 C90.2 C94.1 J15.2 J15.3 J15.4 U9.2(D_SEL) U9.10(GND) U9.12(GND) U9.13(GND) U9.24(GND)
RF_IN: FB2.2 J15.1 U9.11(RF_IN)
NetC94_2: C94.2 FB2.1 R41.1
NetR39_2: U9.18(SDA/SPI_CS_N) ; port SDA
NetR40_2: U9.19(SCL/SPI_CLK) ; port SCL

Not connected (* = marked no-connect by the designer): U9 1(SAFEBOOT_N) 3(TIMEPULSE) 4(EXTINT) 5(USB_DM) 6(USB_DP) 8(RESET_N) 14(LNA_EN) 15(RESERVED)* 16(RESERVED)* 17(RESERVED)* 20(TXD/SPI_MISO) 21(RXD/SPI_MOSI)

### Layout directives
net class 50SE: (no net found under the mark)

### Library data of the parts
C64 C86 C89 C90 = CMP-13271-001936-1: as C1 on sheet PreciseGNSS; Depth: 0.5mm; Case Code (Imperial): 0402; Material: Ceramic; Mount: Surface Mount; Thickness: 0.022inch; Dielectric: X5R; Radiation Hardening: No; Case/Package: 0402; Length: 1mm; Tolerance: 10%; Max Operating Temperature: 85°C; Package Quantity: 1; Width: 0.02inch; Voltage Rating: 10V; Contact Plating: Tin; Height: 0.5mm; Min Operating Temperature: -55°C; Case Code (Metric): 1005; Packaging: Tape and Reel
C65 C85 C87 C88 = CMP-06035-003995-1: as C5 on sheet PreciseGNSS; Resistor Type: Ceramic; Tolerance: 10%; Case Code (Metric): 1005; Termination: SMD/SMT; Mount: Surface Mount; Voltage Rating: 25V; Voltage Rating (DC): 25V; Case Code (Imperial): 0402; Max Operating Temperature: 125°C; Weight: 0.000212oz; Case/Package: 0402; Length: 0.039inch; Width: 0.5mm; Thickness: 0.022inch; Height: 0.5mm; Packaging: Tape and Reel; Package Quantity: 50000; Min Operating Temperature: -55°C; Dielectric: X7R
C94 = CMP-2008-04368-1: Manufacturer: Murata; Part Number: GRM1555C1H470JA01D
FB2 = CMP-0686-00154-4: as FB1 on sheet PreciseGNSS; Lead Free: Lead Free; Min Operating Temperature: -55°C; Package Quantity: 10000; Tolerance: 25%; REACH SVHC: No SVHC; Termination: SMD/SMT; Number of Pins: 2; Frequency: 100MHz; Weight: 2.3E-05oz; Test Frequency: 100MHz; Series: BLM15H; Max DC Current: 300mA; Packaging: Tape and Reel; Width: 0.5mm; Max Current Rating: 300mA; Height: 0.5mm; Depth: 0.55mm; Case Code (Imperial): 0402; RoHS Compliant: Yes; Max Operating Temperature: 125°C; Current Rating: 300mA; Case Code (Metric): 1005; Number of Circuits: 1; Length: 1mm; Case/Package: 0402
J15 = CMP-1743-00001-1: as J7 on sheet LTEMSubsystem; ComponentLink1Description: Datasheet; PackageDescription: 4-Pin Surface Mount Device, Body 2.6 x 2.6 mm; Radiation Hardening: No; Package Quantity: 1; REACH SVHC: No SVHC; DatasheetVersion: Rev. K, 05/2016; ComponentLink1URL: http://drawings.amphenolrf.com/Customer_Outline/CA-1JB.pdf; Pins: 2; Packaging: Tape and Reel; Min Operating Temperature: -55 degC; RoHSCompliant: true; Length: 7.3 mm; PackageReference: A-1JB; Weight: 0.023634 oz; Mount: Surface Mount; Voltage Rating: 10 V; Max Operating Temperature: 125 degC; Height: 3.1 mm; Case Code (Imperial): 2917; Case Code (Metric): 7343; Width: 4.3 mm
R41 = CMP-2002-01791-3: as R1 on sheet PreciseGNSS; Min Operating Temperature: -55°C; Packaging: Tape and Reel; Number of Terminations: 2; Max Operating Temperature: 155°C; Size Code: 0402; Ratings: AEC-Q200; Tolerance: 1%; Resistor Type: Thick Film; Length: 1mm; Width: 0.5mm; Height: 0.32mm; Termination: SMD/SMT; Case/Package: 0402; Case Code (Metric): 1005; Lead Free: Lead Free; Features: Moisture Resistant; Series: AC; Case Code (Imperial): 0402
U9 = CMP-2000-07559-1: U-Blox M8 Concurrent Gnss Module, 3.6 V, -40 to 85 degC, 24-Pin SMD, RoHS, Tape and Reel; Mounting Technology: SurfaceMount; Manufacturer: U-Blox; Manufacturer URL: https://www.u-blox.com/en; Package Reference: NEO-M8N-0; Datasheet Version: Rev. R03, 08/2016; RoHSCompliant: False; Package URL: https://www.u-blox.com/sites/default/files/NEO-8Q-NEO-M8-FW3_HardwareIntegrationManual_%28UBX-15029985%29.pdf; Datasheet URL: https://www.u-blox.com/sites/default/files/NEO-M8-FW3_DataSheet_%28UBX-15031086%29.pdf; Package Description: 24-Pin Surface Mount Device, Body 16 x 12.2 mm, Pitch 1.1 mm

## Sheet UWBSubsystem.SchDoc
size A4; SheetNumber: 13; SheetTotal: 13
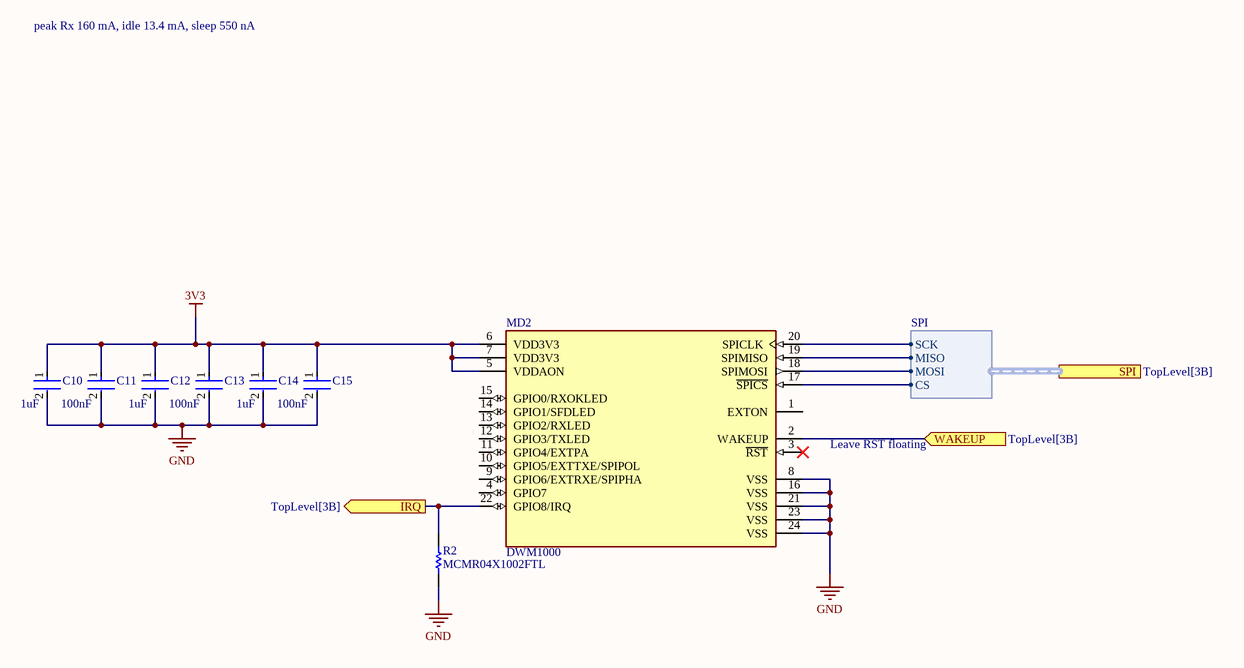
[diagram p12: UWBSubsystem.SchDoc]

### Parts
C10  Capacitance: 1uF  [FP-CL511-IPC_C]  (hidden comment: CL05A105KP5NNNC)
C11  Capacitance: 100nF  [FP-GRM155-0_05-IPC_C]  (hidden comment: GRM155R71E104KE14J)
C12  Capacitance: 1uF  [FP-CL511-IPC_C]  (hidden comment: CL05A105KP5NNNC)
C13  Capacitance: 100nF  [FP-GRM155-0_05-IPC_C]  (hidden comment: GRM155R71E104KE14J)
C14  Capacitance: 1uF  [FP-CL511-IPC_C]  (hidden comment: CL05A105KP5NNNC)
C15  Capacitance: 100nF  [FP-GRM155-0_05-IPC_C]  (hidden comment: GRM155R71E104KE14J)
MD2  DWM1000  [FP-DWM1000-MFG]
R2  MCMR04X1002FTL  [RESC1005X40X25NL05T10]

### Ports
IRQ (out, see TopLevel[3B]), SPI (harness SPI, see TopLevel[3B]), WAKEUP (in, see TopLevel[3B])

### Harnesses
SPI: SCK, MISO, MOSI, CS

### Nets
3V3: C10.1 C11.1 C12.1 C13.1 C14.1 C15.1 MD2.5(VDDAON) MD2.6(VDD3V3) MD2.7(VDD3V3)  [project net GPIO_VDD]
GND: C10.2 C11.2 C12.2 C13.2 C14.2 C15.2 MD2.8(VSS) MD2.16(VSS) MD2.21(VSS) MD2.23(VSS) MD2.24(VSS) R2.1
NetJ4_3: MD2.18(SPIMOSI) ; port SPI.MOSI
NetJ4_5: MD2.20(SPICLK) ; port SPI.SCK
NetJ4_7: MD2.19(SPIMISO) ; port SPI.MISO
NetMD2_2: MD2.2(WAKEUP) ; port WAKEUP
NetMD2_17: MD2.17(~{SPICS}) ; port SPI.CS
NetMD2_22: MD2.22(GPIO8/IRQ) R2.2 ; port IRQ

Not connected (* = marked no-connect by the designer): MD2 1(EXTON) 3(~{RST})* 4(GPIO7) 9(GPIO6/EXTRXE/SPIPHA) 10(GPIO5/EXTTXE/SPIPOL) 11(GPIO4/EXTPA) 12(GPIO3/TXLED) 13(GPIO2/RXLED) 14(GPIO1/SFDLED) 15(GPIO0/RXOKLED)

### Notes on the sheet
- peak Rx 160 mA, idle 13.4 mA, sleep 550 nA
- Leave RST floating

### Library data of the parts
C10 C12 C14 = CMP-13271-001936-1: as C1 on sheet PreciseGNSS; Depth: 0.5mm; Case Code (Imperial): 0402; Material: Ceramic; Mount: Surface Mount; Thickness: 0.022inch; Dielectric: X5R; Radiation Hardening: No; Case/Package: 0402; Length: 1mm; Tolerance: 10%; Max Operating Temperature: 85°C; Package Quantity: 1; Width: 0.02inch; Voltage Rating: 10V; Contact Plating: Tin; Height: 0.5mm; Min Operating Temperature: -55°C; Case Code (Metric): 1005; Packaging: Tape and Reel
C11 C13 C15 = CMP-06035-003995-1: as C5 on sheet PreciseGNSS; Resistor Type: Ceramic; Tolerance: 10%; Case Code (Metric): 1005; Termination: SMD/SMT; Mount: Surface Mount; Voltage Rating: 25V; Voltage Rating (DC): 25V; Case Code (Imperial): 0402; Max Operating Temperature: 125°C; Weight: 0.000212oz; Case/Package: 0402; Length: 0.039inch; Width: 0.5mm; Thickness: 0.022inch; Height: 0.5mm; Packaging: Tape and Reel; Package Quantity: 50000; Min Operating Temperature: -55°C; Dielectric: X7R
MD2 = CMP-231853-000001-1: RX TXRX MODULE 802.15.4 CHIP SMD
R2 = CMP-2002-06479-1: Manufacturer: Multicomp; Part Number: MCMR04X1002FTL

## Nets that join several sheets
GND: BMS (7 pins), TopLevel (J10.1 J11.1 J12.1 J13.1), MCUsubsystem (45 pins), MCUReset (C62.2 R20.1 U7.2), SerialConnector (C57.2 P1.3 U10.3), LoRaSubsystem (46 pins), LTEMSubsystem (55 pins), MicroSDcard (7 pins), PowerSubsystem (J5.2), DCDC_Converter (13 pins), PreciseGNSS (69 pins), RoughGNSS (17 pins), UWBSubsystem (12 pins)
GPIO_VDD: MCUsubsystem (18 pins), MCUReset (C62.1 R18.2 R19.2 U7.6), SerialConnector (C57.1 U10.5), LoRaSubsystem (19 pins), LTEMSubsystem (12 pins), MicroSDcard (7 pins), PreciseGNSS (12 pins), RoughGNSS (13 pins), UWBSubsystem (9 pins)
VOUT2: MCUsubsystem (25 pins), MCUReset (R17.2)
VSYS: BMS (C60.1 U6.4), PowerSubsystem (J5.1), DCDC_Converter (5 pins)
NetJ4_2: MCUsubsystem (U1#1.40), MicroSDcard (J4.2 R24.1)
NetJ4_3: MCUsubsystem (U1#1.93), MicroSDcard (J4.3 R23.1), PreciseGNSS (MD1.43), UWBSubsystem (MD2.18)
NetJ4_5: MCUsubsystem (U1#1.95), MicroSDcard (J4.5 R22.1), PreciseGNSS (MD1.45), UWBSubsystem (MD2.20)
NetJ4_7: MCUsubsystem (U1#1.94), MicroSDcard (J4.7 R21.1), PreciseGNSS (MD1.42), UWBSubsystem (MD2.19)
NetMD1_44: MCUsubsystem (U1#1.105), PreciseGNSS (MD1.44)
NetMD2_2: MCUsubsystem (U1#1.25), UWBSubsystem (MD2.2)
NetMD2_17: MCUsubsystem (U1#1.130), UWBSubsystem (MD2.17)
NetMD2_22: MCUsubsystem (U1#1.23), UWBSubsystem (MD2.22 R2.2)
NetP1_1: MCUsubsystem (U1#1.38), SerialConnector (P1.1)
NetR19_1: MCUsubsystem (U1#1.46), MCUReset (R19.1 U7.1 U7.5)
NetR26_1: MCUsubsystem (U1#1.132), LoRaSubsystem (R26.1)
NetR27_2: MCUsubsystem (U1#1.2), LoRaSubsystem (R27.2)
NetR28_1: MCUsubsystem (U1#1.131), LoRaSubsystem (R28.1)
NetR39_2: MCUsubsystem (R39.2 U1#1.4), LTEMSubsystem (U3.59), RoughGNSS (U9.18)
NetR40_2: MCUsubsystem (R40.2 U1#1.3), LTEMSubsystem (U3.58), RoughGNSS (U9.19)
NetU1#1_39: MCUsubsystem (U1#1.39), SerialConnector (U10.4)